# Altium schematic sheet ESP32SchematicPG2[1].SchDoc
size A; SheetNumber: 2; SheetTotal: 2
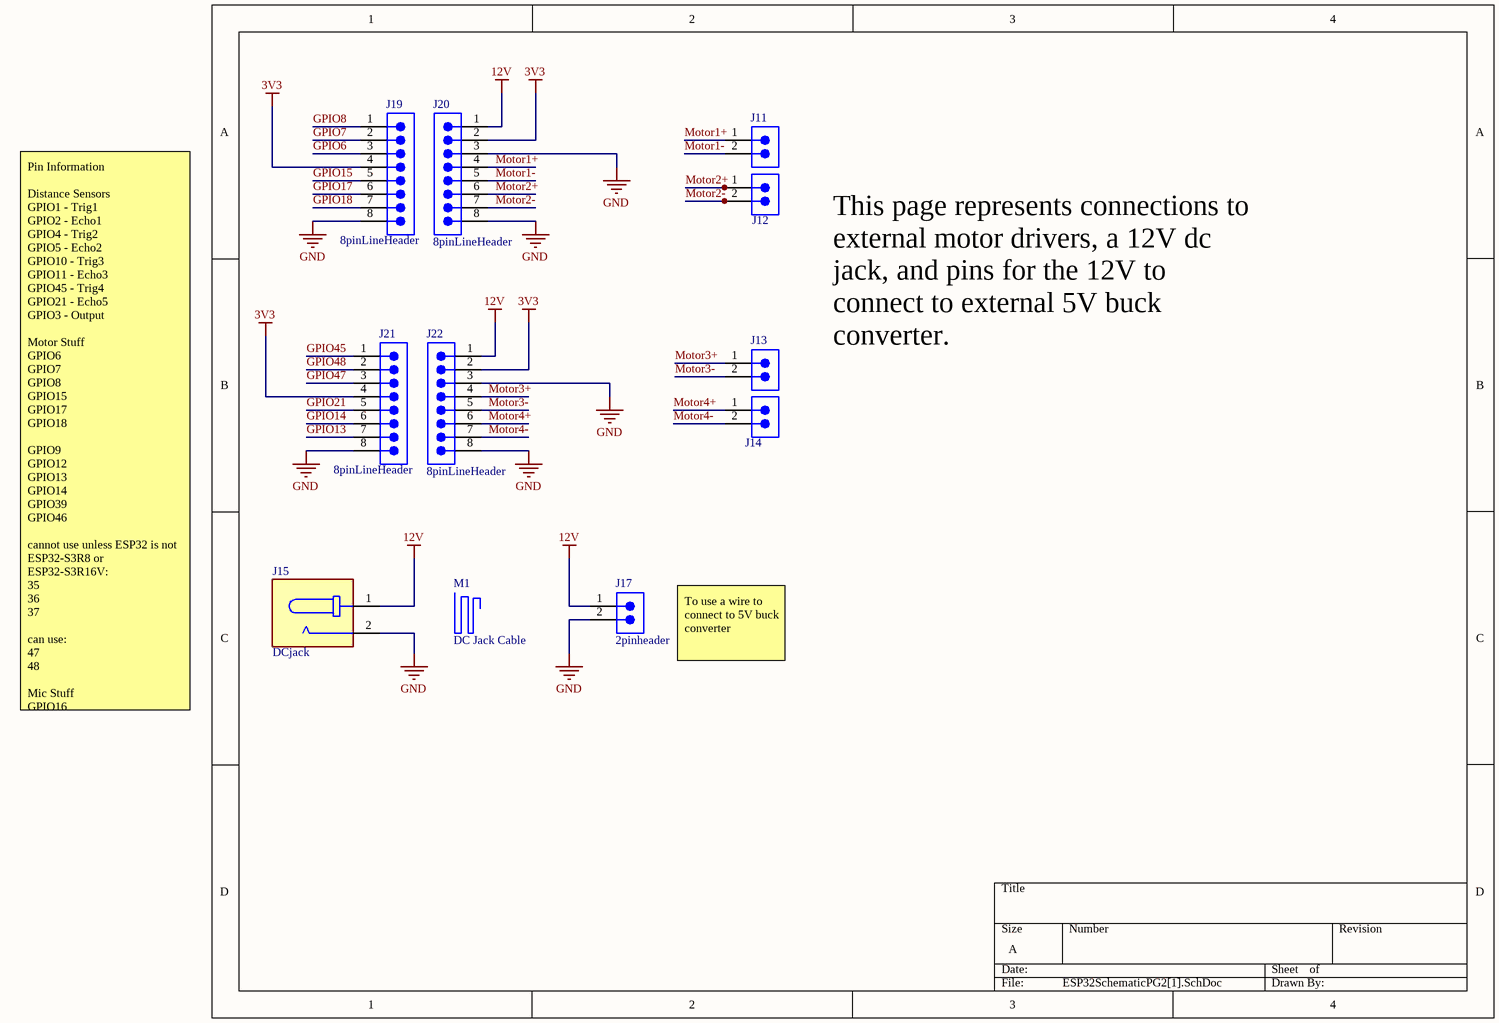
[diagram p0: ESP32SchematicPG2[1].SchDoc]

## Parts
J11  2pinheader  [61300211121]  (value not drawn)
J12  2pinheader  [61300211121]  (value not drawn)
J13  2pinheader  [61300211121]  (value not drawn)
J14  2pinheader  [61300211121]  (value not drawn)
J15  DCjack  [CUI_PJ-037B]
J17  2pinheader  [61300211121]
J19  8pinLineHeader  [PPTC081LFBN-RC]
J20  8pinLineHeader  [PPTC081LFBN-RC]
J21  8pinLineHeader  [PPTC081LFBN-RC]
J22  8pinLineHeader  [PPTC081LFBN-RC]
M1  DC Jack Cable  (mechanical)

## Nets
3V3: J19.4 J20.2 J21.4 J22.2
12V: J15.1 J17.1 J20.1 J22.1
GND: J15.2 J17.2 J19.8 J20.3 J20.8 J21.8 J22.3 J22.8
GPIO6: J19.3
GPIO7: J19.2
GPIO8: J19.1
GPIO13: J21.7
GPIO14: J21.6
GPIO15: J19.5
GPIO17: J19.6
GPIO18: J19.7
GPIO21: J21.5
GPIO45: J21.1
GPIO47: J21.3
GPIO48: J21.2
Motor1+: J11.1 J20.4
Motor1-: J11.2 J20.5
Motor2+: J12.1 J20.6
Motor2-: J12.2 J20.7
Motor3+: J13.1 J22.4
Motor3-: J13.2 J22.5
Motor4+: J14.1 J22.6
Motor4-: J14.2 J22.7

## Notes on the sheet
- Pin Information
  Distance Sensors
  GPIO1 - Trig1
  GPIO2 - Echo1
  GPIO4 - Trig2
  GPIO5 - Echo2
  GPIO10 - Trig3
  GPIO11 - Echo3
  GPIO45 - Trig4
  GPIO21 - Echo5
  GPIO3 - Output
  Motor Stuff
  GPIO6
  GPIO7
  GPIO8
  GPIO15
  GPIO17
  GPIO18
  GPIO9
  GPIO12
  GPIO13
  GPIO14
  GPIO39
  GPIO46
  cannot use unless ESP32 is not ESP32-S3R8 or ESP32-S3R16V:
  35
  36
  37
  can use:
  47
  48
  Mic Stuff
  GPIO16
  GPIO40
  GPIO41
  GPIO42
- To use a wire to connect to 5V buck converter
- This page represents connections to external motor drivers, a 12V dc jack, and pins for the 12V to connect to external 5V buck converter.

## Library data of the parts
J11-J14 J17 = 61300211121: WR-PHD Straight Male, PCB Header, Through Hole, 1 Rows, 2 Contacts, 2.54mm Pitch; Manufacturer: Wurth Elektronik; Connector Type: Male Pin; Contact Resistance: 20mΩ; Current Rating: 3A; Insulation Resistance: 1GΩ; Number of Contacts: 2; Operating Supply Voltage: 250V; Supplier: DigiKey; Supplier Part Number: 732-5315-ND; Manufacturer Part Number: 61300211121; RoHS: Compliant; Category: Headers and Wire Housings; Stock: 193921; Pricing: 1=0.12, 10=0.102, 25=0.0848, 50=0.0712, 100=0.0639, 1000=0.06 (USD); Color: Black; Contact Gender: Male; Contact Material: Gold; Contact Mating Length: 5.9944mm; Contact Plating: Gold; Gender: Male; Height: 8.94mm; Housing Material: PBT; Lead Free: Lead Free; Lead Pitch: 2.54mm; Length: 5.08mm; Max Operating Temperature: 105°C; Min Operating Temperature: -40°C; Mounting Technology: Through Hole; Pins: 2; Number of Positions: 2; Number of Rows: 1; Orientation: Vertical; Packaging: Bulk; Pitch: 2.54mm; REACH SVHC: No; Termination: Through Hole; Voltage Rating: 250V; ComponentLink1URL: https://datasheet.octopart.com:443/61300211121-Wurth-Elektronik-datasheet-168684095.pdf?src-supplier=Wurth+Elektronik; ComponentLink1Description: https://datasheet.octopart.com:443/61300211121-Wurth-Elektronik-datasheet-168684095.pdf?src-supplier=Wurth+Elektronik; ComponentLink2URL: https://datasheet.octopart.com:443/61300211121-W%C3%BCrth-Elektronik-datasheet-44382959.pdf?src-supplier=Future+Electronics; ComponentLink2Description: https://datasheet.octopart.com:443/61300211121-W%C3%BCrth-Elektronik-datasheet-44382959.pdf?src-supplier=Future+Electronics; ComponentLink3URL: https://datasheet.octopart.com:443/61300211121-W%C3%BCrth-Elektronik-datasheet-149524045.pdf?src-supplier=Farnell; ComponentLink3Description: https://datasheet.octopart.com:443/61300211121-W%C3%BCrth-Elektronik-datasheet-149524045.pdf?src-supplier=Farnell; ComponentLink4URL: https://datasheet.octopart.com:443/61300211121-W%C3%BCrth-Elektronik-datasheet-21154836.pdf?src-supplier=element14+APAC; ComponentLink4Description: https://datasheet.octopart.com:443/61300211121-W%C3%BCrth-Elektronik-datasheet-21154836.pdf?src-supplier=element14+APAC
J15 = PJ-037B: 2.5 x 6.5 mm, 2.5 A, Horizontal, Through Hole, Dc Power Jack Connector; Manufacturer: Same Sky; Current Rating: 2.5A; Inside Diameter: 2.5mm; Number of Conductors: 2; Outside Diameter: 6.5mm; Shielding: No; Voltage Rating: 24V; Supplier: DigiKey; Supplier Part Number: CP-037B-ND; Manufacturer Part Number: PJ-037B; RoHS: Compliant; Category: Power Connectors; Stock: 35819; Pricing: 1=0.51, 10=0.431, 25=0.4044, 50=0.385, 100=0.3665, 250=0.34352, 500=0.3271, 1000=0.31147, 2500=0.29196 (USD); Contact Material: Brass; Contact Plating: Tin; Lifecycle Status: Production; Mounting Technology: Through Hole; REACH SVHC: Yes; Schedule B: 8536695050, 8536695050|8536695050, 8536695050|8536695050|8536695050, 8536695050|8536695050|8536695050|8536695050; Voltage Rating (DC): 24V; ComponentLink1URL: https://datasheet.octopart.com:443/PJ-037B-Same-Sky-datasheet-188828269.pdf?src-supplier=Same+Sky; ComponentLink1Description: https://datasheet.octopart.com:443/PJ-037B-Same-Sky-datasheet-188828269.pdf?src-supplier=Same+Sky; ComponentLink2URL: https://datasheet.octopart.com:443/PJ-037B-Same-Sky-datasheet-181917287.pdf?src-supplier=Same+Sky; ComponentLink2Description: https://datasheet.octopart.com:443/PJ-037B-Same-Sky-datasheet-181917287.pdf?src-supplier=Same+Sky; ComponentLink3URL: https://datasheet.octopart.com:443/PJ-037B-Same-Sky-datasheet-181917286.pdf?src-supplier=Same+Sky; ComponentLink3Description: https://datasheet.octopart.com:443/PJ-037B-Same-Sky-datasheet-181917286.pdf?src-supplier=Same+Sky; ComponentLink4URL: https://datasheet.octopart.com:443/PJ-037B-CUI-Devices-datasheet-175924779.pdf?src-supplier=Same+Sky; ComponentLink4Description: https://datasheet.octopart.com:443/PJ-037B-CUI-Devices-datasheet-175924779.pdf?src-supplier=Same+Sky; ComponentLink5URL: https://datasheet.octopart.com:443/PJ-037B-CUI-Devices-datasheet-137941219.pdf?src-supplier=Same+Sky; ComponentLink5Description: https://datasheet.octopart.com:443/PJ-037B-CUI-Devices-datasheet-137941219.pdf?src-supplier=Same+Sky; ComponentLink6URL: https://datasheet.octopart.com:443/PJ-037B-CUI-Devices-datasheet-180437400.pdf?src-supplier=IHS; ComponentLink6Description: https://datasheet.octopart.com:443/PJ-037B-CUI-Devices-datasheet-180437400.pdf?src-supplier=IHS; ComponentLink7URL: https://datasheet.octopart.com:443/PJ-037B-Same-Sky-datasheet-182880908.pdf?src-supplier=Electro+Sonic; ComponentLink7Description: https://datasheet.octopart.com:443/PJ-037B-Same-Sky-datasheet-182880908.pdf?src-supplier=Electro+Sonic; ComponentLink8URL: https://datasheet.octopart.com:443/PJ-037B-CUI-Devices-datasheet-175925580.pdf?src-supplier=Master+Electronics; ComponentLink8Description: https://datasheet.octopart.com:443/PJ-037B-CUI-Devices-datasheet-175925580.pdf?src-supplier=Master+Electronics; ComponentLink9URL: https://datasheet.octopart.com:443/PJ-037B-CUI-Devices-datasheet-141000227.pdf?src-supplier=Master+Electronics; ComponentLink9Description: https://datasheet.octopart.com:443/PJ-037B-CUI-Devices-datasheet-141000227.pdf?src-supplier=Master+Electronics; ComponentLink10URL: https://datasheet.octopart.com:443/PJ-037B-CUI-Devices-datasheet-103110664.pdf?src-supplier=Master+Electronics; ComponentLink10Description: https://datasheet.octopart.com:443/PJ-037B-CUI-Devices-datasheet-103110664.pdf?src-supplier=Master+Electronics; ComponentLink11URL: https://datasheet.octopart.com:443/PJ-037B-Same-Sky-datasheet-189105172.pdf?src-supplier=Master+Electronics; ComponentLink11Description: https://datasheet.octopart.com:443/PJ-037B-Same-Sky-datasheet-189105172.pdf?src-supplier=Master+Electronics; ComponentLink12URL: https://datasheet.octopart.com:443/PJ-037B-Same-Sky-datasheet-182049853.pdf?src-supplier=Future+Electronics; ComponentLink12Description: https://datasheet.octopart.com:443/PJ-037B-Same-Sky-datasheet-182049853.pdf?src-supplier=Future+Electronics; ComponentLink13URL: https://datasheet.octopart.com:443/PJ-037B-CUI-Devices-datasheet-175923562.pdf?src-supplier=Future+Electronics; ComponentLink13Description: https://datasheet.octopart.com:443/PJ-037B-CUI-Devices-datasheet-175923562.pdf?src-supplier=Future+Electronics; ComponentLink14URL: https://datasheet.octopart.com:443/PJ-037B-CUI-Devices-datasheet-137760685.pdf?src-supplier=Future+Electronics; ComponentLink14Description: https://datasheet.octopart.com:443/PJ-037B-CUI-Devices-datasheet-137760685.pdf?src-supplier=Future+Electronics; ComponentLink15URL: https://datasheet.octopart.com:443/PJ-037B-CUI-Devices-datasheet-175927596.pdf?src-supplier=CUI+Devices+SCT; ComponentLink15Description: https://datasheet.octopart.com:443/PJ-037B-CUI-Devices-datasheet-175927596.pdf?src-supplier=CUI+Devices+SCT; ComponentLink16URL: https://datasheet.octopart.com:443/PJ-037B-CUI-Devices-datasheet-142370758.pdf?src-supplier=CUI+Devices+SCT; ComponentLink16Description: https://datasheet.octopart.com:443/PJ-037B-CUI-Devices-datasheet-142370758.pdf?src-supplier=CUI+Devices+SCT; ComponentLink17URL: https://octopart.com:443/opatz8j6/c1?t=ugIBICy-aquGENpJ5UVE1kONiWm4Jmye08y8HK-0dHugvEvDShjkU2vkALkg81eMeYqXvZhRpG0R8tPN40EocjuskCAh7XxVN8JS1a7nX6yDn71JifNfY55yLydMfUID1IxMe-aG7_idBqI2aybvW_B1_vyNQqKRAl91P9Ny1aLJlgl7jdVw_pwtRfT4Ujqw-bsi_OwdGpNYzqY4SWKQwVW7yzOyktRHaazl5dbIhoFUwRdxDdlgsrKZx7IYVSzXwdqlLXdu6s_3ABRwIRLewOWFjmWEjHc_DG0qkv0PjiuITWn6CbdvXjGiMH0odnPZUlRjUK2KM54VuGAzqWG-d-5NxI2_5YZNMA&src-supplier=Compliance+Statements; ComponentLink17Description: https://octopart.com:443/opatz8j6/c1?t=ugIBICy-aquGENpJ5UVE1kONiWm4Jmye08y8HK-0dHugvEvDShjkU2vkALkg81eMeYqXvZhRpG0R8tPN40EocjuskCAh7XxVN8JS1a7nX6yDn71JifNfY55yLydMfUID1IxMe-aG7_idBqI2aybvW_B1_vyNQqKRAl91P9Ny1aLJlgl7jdVw_pwtRfT4Ujqw-bsi_OwdGpNYzqY4SWKQwVW7yzOyktRHaazl5dbIhoFUwRdxDdlgsrKZx7IYVSzXwdqlLXdu6s_3ABRwIRLewOWFjmWEjHc_DG0qkv0PjiuITWn6CbdvXjGiMH0odnPZUlRjUK2KM54VuGAzqWG-d-5NxI2_5YZNMA&src-supplier=Compliance+Statements; ComponentLink18URL: https://octopart.com:443/opatz8j6/c1?t=xY83QJYeMgOnbRCoY0MJZ0kIo5YAXWIf_KfjZSMQzpzyrl-9JxtFTr69jnymLJkbjzK7Lh6EscJK24nUCwiICczRq7NMp0xGoLCpTn4gxZ7zYxKXZakIj_zjT2uutoWIv4bSHRlvdWmCCDEJby7LfgMYru2nGKwlO6BQJX4zEfs7hC0wK24gbVPjc3w0Y3STzCc5vE401SZFfM-fhIhrbaea6tBhZCBd9UTpy56_2aftF9KpGkqVHM1PWBKk6XRT528tR6sLSTUs4PvC1IA-VCaeEn6UjqcO_AYW1W_1CbF2_ohw-l0h8owecFjxbO9CCibDaBOKVsGDoWbcOMeCxhnLSnLp&src-supplier=Compliance+Statements; ComponentLink18Description: https://octopart.com:443/opatz8j6/c1?t=xY83QJYeMgOnbRCoY0MJZ0kIo5YAXWIf_KfjZSMQzpzyrl-9JxtFTr69jnymLJkbjzK7Lh6EscJK24nUCwiICczRq7NMp0xGoLCpTn4gxZ7zYxKXZakIj_zjT2uutoWIv4bSHRlvdWmCCDEJby7LfgMYru2nGKwlO6BQJX4zEfs7hC0wK24gbVPjc3w0Y3STzCc5vE401SZFfM-fhIhrbaea6tBhZCBd9UTpy56_2aftF9KpGkqVHM1PWBKk6XRT528tR6sLSTUs4PvC1IA-VCaeEn6UjqcO_AYW1W_1CbF2_ohw-l0h8owecFjxbO9CCibDaBOKVsGDoWbcOMeCxhnLSnLp&src-supplier=Compliance+Statements; ComponentLink19URL: https://octopart.com:443/opatz8j6/c1?t=FzGMKkhviOWT8PLmgXVIsGD7OC-ZKcDZSdb9rjzUd-4CdYnadLpmQ77JdXOitmMu4wWORmNPfxYZ17cA6TaEO6Mm1ZgdO8lXcwXJppTA043W0gQ2P4U-7E6ujoGSvuNzQJMAYjSV5q33INZyelMHWI8ENsIoBunWKjTSudwCbgSa82zECeXZpdhIyaUBolyjB6K4eLrM_w-l1dTNFW2JX6bvmSbC1AwvuqFFcPMpPK-A1MOExm4S1J8WQqkV9WeO-mmR1e_4r-vTZ2n8Sy88Wsu_EYkFLu4NtxQoLu7MVh6vC8N1AZg7LWiCGS2Ok64pLyM3awZnEG6CfUT4hTLqw-HWZb4BW3AwSw&src-supplier=Compliance+Statements; ComponentLink19Description: https://octopart.com:443/opatz8j6/c1?t=FzGMKkhviOWT8PLmgXVIsGD7OC-ZKcDZSdb9rjzUd-4CdYnadLpmQ77JdXOitmMu4wWORmNPfxYZ17cA6TaEO6Mm1ZgdO8lXcwXJppTA043W0gQ2P4U-7E6ujoGSvuNzQJMAYjSV5q33INZyelMHWI8ENsIoBunWKjTSudwCbgSa82zECeXZpdhIyaUBolyjB6K4eLrM_w-l1dTNFW2JX6bvmSbC1AwvuqFFcPMpPK-A1MOExm4S1J8WQqkV9WeO-mmR1e_4r-vTZ2n8Sy88Wsu_EYkFLu4NtxQoLu7MVh6vC8N1AZg7LWiCGS2Ok64pLyM3awZnEG6CfUT4hTLqw-HWZb4BW3AwSw&src-supplier=Compliance+Statements; ComponentLink20URL: https://octopart.com:443/opatz8j6/c1?t=yyvtSRofrppp-5KrzO7cVDg_UkI1Q6UEwrOzVOQOIp0n2wkAoZ4RrB1A8L3Fx-rNVFbAG4w0SpWUnSE2EYvc_xCoNcFsz4mWjRDYbK7qXyFxie6BJuhhldDhR2CTLFpcPNAGUkq5xMGzJTFkzHUG2Xp4Owqs3EwllU3_e3OsiGRn8D0IJRAOELGfXrDY2XigBaSyPkyUIYCXsKazcIG_RxmnY6Umsst-42oAFgQzEcY0KbnV4ZcHR8-zLKv--FJ4Mts6nsXDR5OGkd2fB0oceMNf2TFHBMNUzSQjnwujgTz6-O4srKLl763V3rMq7gnR7z5AAFxOnZINBCQgGlAyc9xKVT2w&src-supplier=Compliance+Statements; ComponentLink20Description: https://octopart.com:443/opatz8j6/c1?t=yyvtSRofrppp-5KrzO7cVDg_UkI1Q6UEwrOzVOQOIp0n2wkAoZ4RrB1A8L3Fx-rNVFbAG4w0SpWUnSE2EYvc_xCoNcFsz4mWjRDYbK7qXyFxie6BJuhhldDhR2CTLFpcPNAGUkq5xMGzJTFkzHUG2Xp4Owqs3EwllU3_e3OsiGRn8D0IJRAOELGfXrDY2XigBaSyPkyUIYCXsKazcIG_RxmnY6Umsst-42oAFgQzEcY0KbnV4ZcHR8-zLKv--FJ4Mts6nsXDR5OGkd2fB0oceMNf2TFHBMNUzSQjnwujgTz6-O4srKLl763V3rMq7gnR7z5AAFxOnZINBCQgGlAyc9xKVT2w&src-supplier=Compliance+Statements
J19-J22 = PPTC081LFBN-RC: Female, 8C, Straight, .100"CC; 3.20mm Tail, No Mt. 100u" Tin; PBT, Phos Bronze, 105 C; Manufacturer: Sullins; Connector Type: Header, Socket; Current Rating: 3A; Dielectric Material: Polyester; Number of Positions: 8; Pitch: 2.54mm; Plating Thickness: 2.54µm; Supplier: DigiKey; Supplier Part Number: S7006-ND; Manufacturer Part Number: PPTC081LFBN-RC; RoHS: Compliant; Category: Card Edge Connectors; Stock: 36413; Pricing: 1=0.51, 10=0.435, 400=0.33535, 800=0.31933, 1200=0.31031, 5200=0.2798, 10000=0.26719 (USD); Color: Black; Contact Gender: Female; Contact Material: Bronze; Contact Plating: Tin; Height: 8.5mm; Housing Material: Plastic; Lead Free: Lead Free; Length: 20.8mm; Lifecycle Status: Production; Max Operating Temperature: 105°C; Min Operating Temperature: -40°C; Mounting Technology: Through Hole; Pins: 8; Number of Rows: 1; Packaging: Bulk; REACH SVHC: Yes; Terminal Pitch: 2.54mm; Termination: Solder; Width: 2.5mm; ComponentLink1URL: https://datasheet.octopart.com:443/PPTC081LFBN-RC-Sullins-datasheet-138810743.pdf?src-supplier=IHS; ComponentLink1Description: https://datasheet.octopart.com:443/PPTC081LFBN-RC-Sullins-datasheet-138810743.pdf?src-supplier=IHS; ComponentLink2URL: https://datasheet.octopart.com:443/PPTC081LFBN-RC-Sullins-datasheet-47864048.pdf?src-supplier=Upverter; ComponentLink2Description: https://datasheet.octopart.com:443/PPTC081LFBN-RC-Sullins-datasheet-47864048.pdf?src-supplier=Upverter; ComponentLink3URL: https://datasheet.octopart.com:443/PPTC081LFBN-RC-Sullins-datasheet-41308905.pdf?src-supplier=Future+Electronics; ComponentLink3Description: https://datasheet.octopart.com:443/PPTC081LFBN-RC-Sullins-datasheet-41308905.pdf?src-supplier=Future+Electronics; ComponentLink4URL: https://datasheet.octopart.com:443/PPTC081LFBN-RC-Sullins-datasheet-12511165.pdf?src-supplier=Future+Electronics; ComponentLink4Description: https://datasheet.octopart.com:443/PPTC081LFBN-RC-Sullins-datasheet-12511165.pdf?src-supplier=Future+Electronics
M1 = FC592505: Dc Pwr Cord, 2.5Mm Pl-Free End, 0.5M/Blk Rohs Compliant: Yes |Cliff Electronic Components FC592505; Manufacturer: Cliff; Supplier: DigiKey; Supplier Part Number: 4654-FC592505-ND; Manufacturer Part Number: FC592505; Category: Power Cords; Stock: 68; Pricing: 1=1.92, 10=1.629, 25=1.5264, 50=1.4536, 100=1.3841, 300=1.28073, 500=1.2354, 1000=1.17644, 2500=1.10282 (USD); ComponentLink1URL: https://datasheet.octopart.com:443/FC592505-Cliff-datasheet-189913458.pdf?src-supplier=element14+APAC; ComponentLink1Description: https://datasheet.octopart.com:443/FC592505-Cliff-datasheet-189913458.pdf?src-supplier=element14+APAC